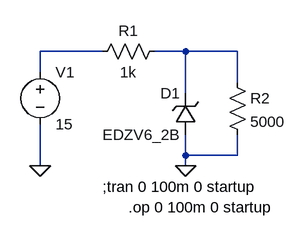
[diagram p0: schematic zener.asc]
zener.asc, the LTspice schematic file:
Version 4
SHEET 1 880 680
WIRE 160 96 64 96
WIRE 288 96 240 96
WIRE 368 96 288 96
WIRE 64 128 64 96
WIRE 368 144 368 96
WIRE 288 160 288 96
WIRE 288 256 288 224
WIRE 368 256 368 224
WIRE 368 256 288 256
WIRE 64 272 64 208
WIRE 288 272 288 256
FLAG 288 272 0
FLAG 64 272 0
DATAFLAG 368 128 ""
SYMBOL voltage 64 112 R0
SYMATTR InstName V1
SYMATTR Value 15
SYMBOL res 256 80 R90
WINDOW 0 0 56 VBottom 2
WINDOW 3 32 56 VTop 2
SYMATTR InstName R1
SYMATTR Value 1k
SYMBOL res 352 128 R0
SYMATTR InstName R2
SYMATTR Value 5000
SYMBOL zener 304 224 R180
WINDOW 0 24 64 Left 2
WINDOW 3 24 0 Left 2
SYMATTR InstName D1
SYMATTR Value EDZV6_2B
TEXT 160 304 Left 2 !;tran 0 100m 0 startup
TEXT 200 336 Left 2 !.op 0 100m 0 startup

The netlist it stands for:
* zener.asc
V1 N001 0 15
R1 N002 N001 1k
R2 N002 0 5000
D1 0 N002 EDZV6_2B
.model D D
.lib standard.dio
;tran 0 100m 0 startup
.op 0 100m 0 startup
.backanno
.end